# EAGLE design rcz80cpuv1 (EAGLE 9.6.2)
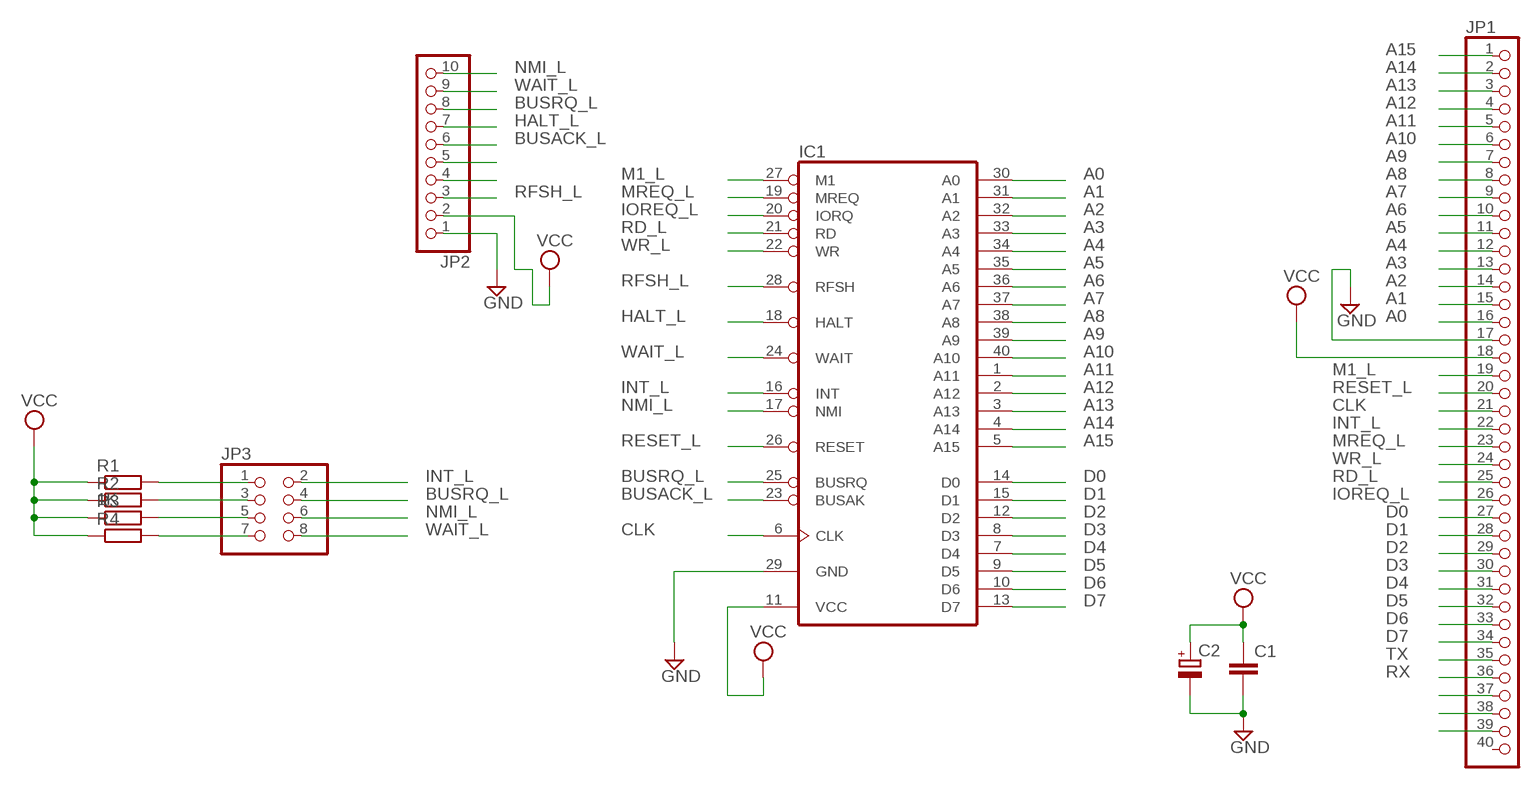
[diagram p0: schematic, sheet 1]

## Parts
C1  C-EU025-024X044  [C025-024X044]
C2  CPOL-EUE2,5-6E  [E2,5-6E]
IC1  Z80CPU  [DIL40]
JP1  PINHD-1X40  [1X40]
JP2  PINHD-1X10  [1X10]
JP3  PINHD-2X4  [2X04]
R1  1K  R-EU_0204/7  [0204/7]
R2  R-EU_0204/7  [0204/7]
R3  R-EU_0204/7  [0204/7]
R4  R-EU_0204/7  [0204/7]

## Nets
A0: IC1.30(A0) JP1.16
A1: IC1.31(A1) JP1.15
A2: IC1.32(A2) JP1.14
A3: IC1.33(A3) JP1.13
A4: IC1.34(A4) JP1.12
A5: IC1.35(A5) JP1.11
A6: IC1.36(A6) JP1.10
A7: IC1.37(A7) JP1.9
A8: IC1.38(A8) JP1.8
A9: IC1.39(A9) JP1.7
A10: IC1.40(A10) JP1.6
A11: IC1.1(A11) JP1.5
A12: IC1.2(A12) JP1.4
A13: IC1.3(A13) JP1.3
A14: IC1.4(A14) JP1.2
A15: IC1.5(A15) JP1.1
BUSACK_L: IC1.23(BUSAK) JP2.6
BUSRQ_L: IC1.25(BUSRQ) JP2.8 JP3.4
CLK: IC1.6(CLK) JP1.21
D0: IC1.14(D0) JP1.27
D1: IC1.15(D1) JP1.28
D2: IC1.12(D2) JP1.29
D3: IC1.8(D3) JP1.30
D4: IC1.7(D4) JP1.31
D5: IC1.9(D5) JP1.32
D6: IC1.10(D6) JP1.33
D7: IC1.13(D7) JP1.34
GND: C1.2 C2.- IC1.29(GND) JP1.17 JP2.1
HALT_L: IC1.18(HALT) JP2.7
INT_L: IC1.16(INT) JP1.22 JP3.2
IOREQ_L: IC1.20(IORQ) JP1.26
M1_L: IC1.27(M1) JP1.19
MREQ_L: IC1.19(MREQ) JP1.23
N$1: JP1.37
N$2: JP1.38
N$3: JP1.39
N$4: JP3.1 R1.2
N$5: JP3.3 R2.2
N$6: JP2.5
N$7: JP2.4
N$8: JP3.5 R3.2
N$9: JP3.7 R4.2
NMI_L: IC1.17(NMI) JP2.10 JP3.6
RD_L: IC1.21(RD) JP1.25
RESET_L: IC1.26(RESET) JP1.20
RFSH_L: IC1.28(RFSH) JP2.3
RX: JP1.36
TX: JP1.35
VCC: C1.1 C2.+ IC1.11(VCC) JP1.18 JP2.2 R1.1 R2.1 R3.1 R4.1
WAIT_L: IC1.24(WAIT) JP2.9 JP3.8
WR_L: IC1.22(WR) JP1.24
Unconnected: JP1.40

## Library data of the parts
C1 = rcl:C-EU: CAPACITOR, European symbol; SPICEPREFIX: C
C2 = rcl:CPOL-EU: POLARIZED CAPACITOR, European symbol; SPICEPREFIX: C
IC1 = zilog:Z80CPU: Z80 FAMILY DEVICE
JP1 = pinhead:PINHD-1X40: PIN HEADER
JP2 = pinhead:PINHD-1X10: PIN HEADER
JP3 = pinhead:PINHD-2X4: PIN HEADER
R1-R4 = rcl:R-EU_: RESISTOR, European symbol; SPICEPREFIX: R

## Board
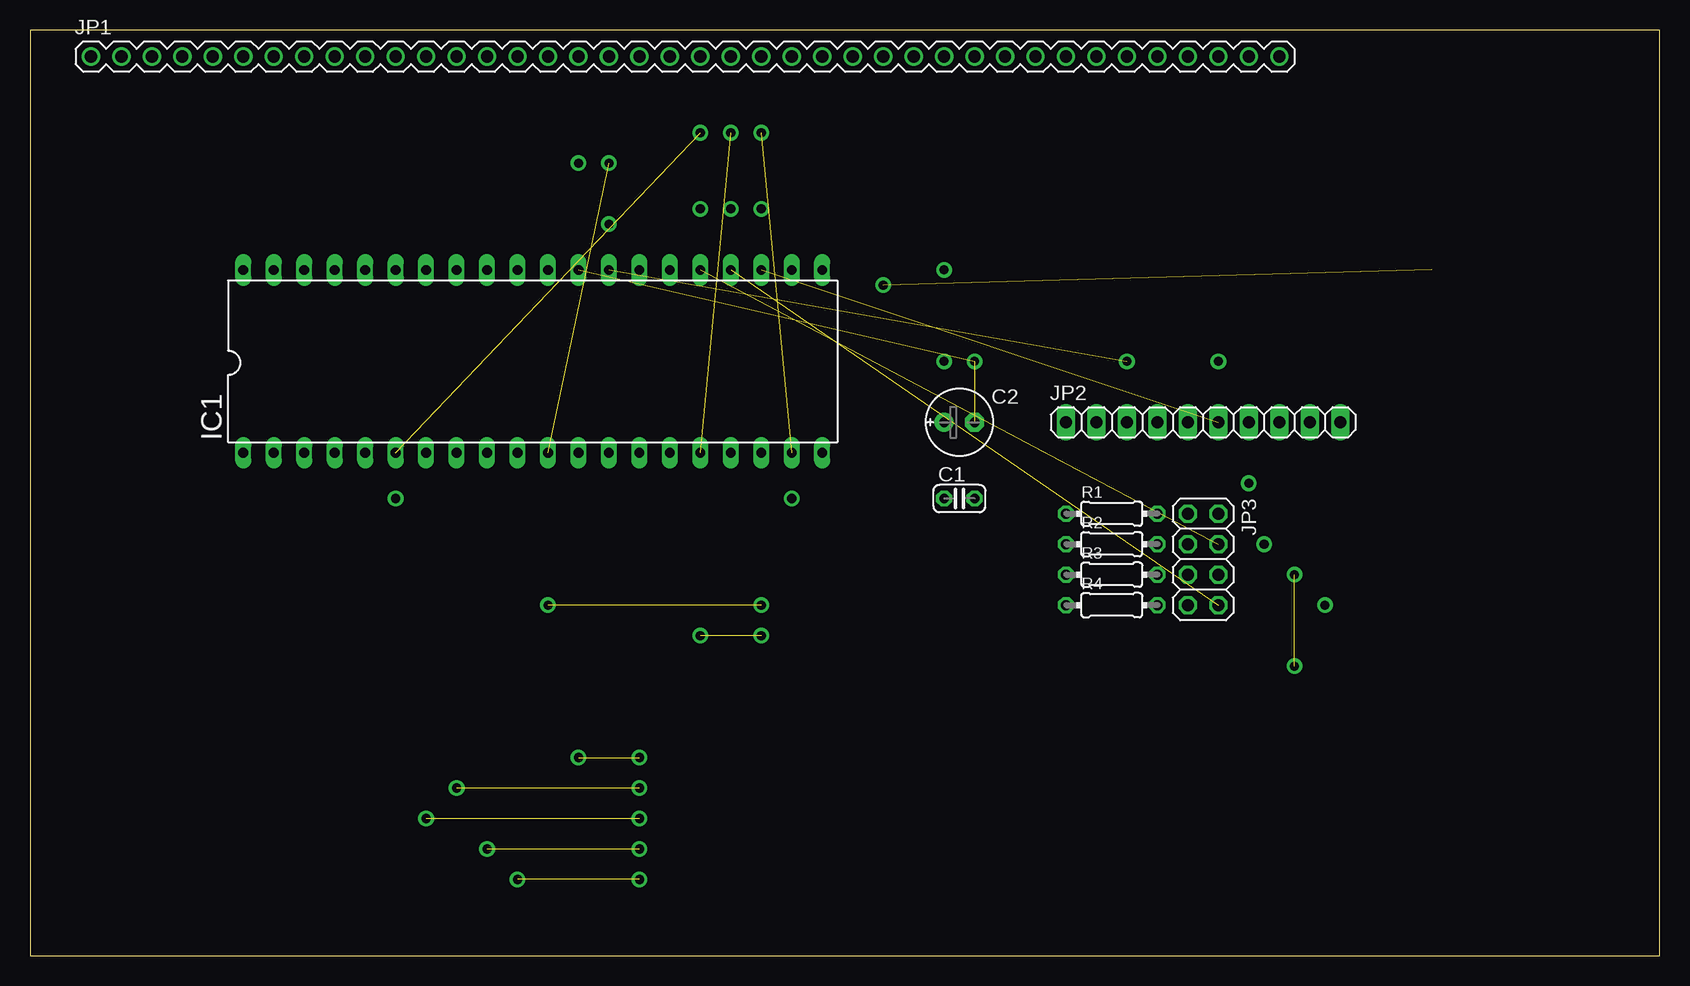
[diagram p1: board, top side]
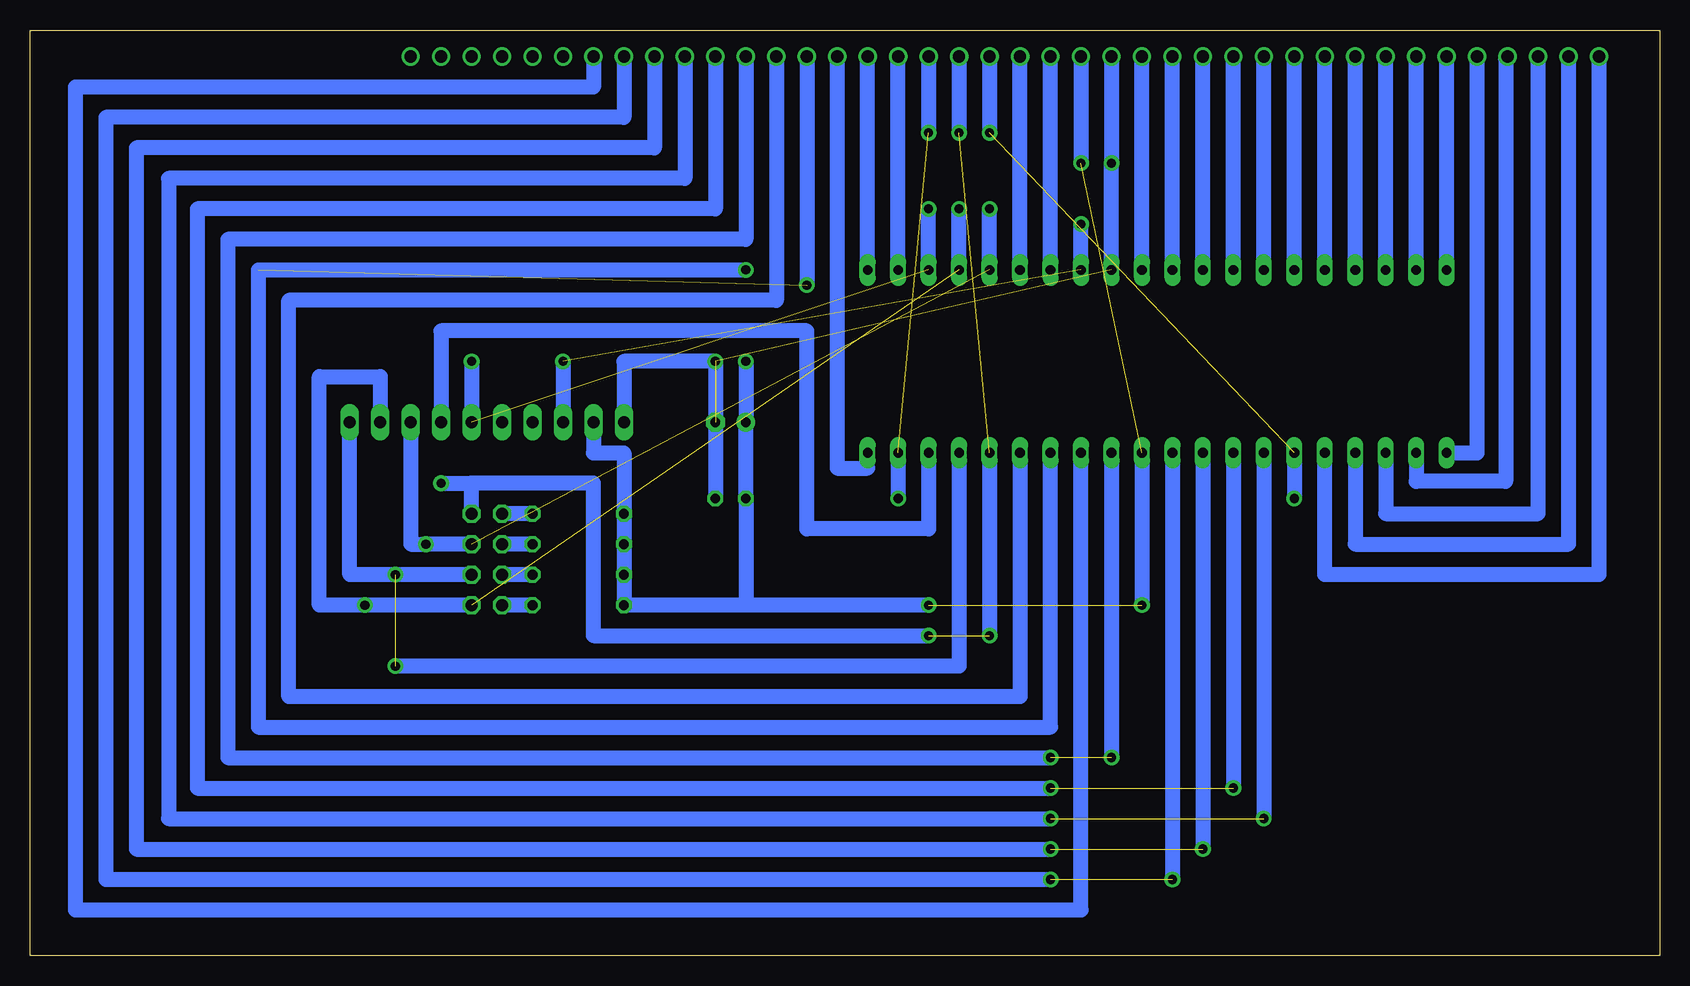
[diagram p2: board, bottom side, seen from below]

Size 135.87 x 77.14 mm. Coordinates in mm from the lower left corner, seen from the top.
Outline: 0,0 135.87,0 135.87,77.14 0,77.14 0,0
Copper layers (1*16): Top 0.035mm / dielectric 1.5mm / Bottom 0.035mm
Design rules "default": minimum track width 6mil, minimum drill 0.35mm, track to track 6mil, track to pad 6mil, pad to pad 6mil, via to via 6mil, smd to smd 6mil, copper to edge 40mil, drill to drill 6mil, minimum pad ring 10mil, minimum via ring 8mil, stop-mask expansion 4mil, vias tented up to drill 0mil, thermal gap 10mil

### Footprints (pad centres in the part's own frame; a part is rotated, then mirrored left to right if it is on the bottom)
C025-024X044 = drill 0.813 octagon: 1 -1.27,0; 2 1.27,0
E2,5-6E = drill 0.813 pad 1.575: + -1.27,0 | drill 0.813 pad 1.575 octagon: - 1.27,0
DIL40 = drill 0.813 long: 1 -24.13,-7.62; 2 -21.59,-7.62; 3 -19.05,-7.62; 4 -16.51,-7.62; 5 -13.97,-7.62; 6 -11.43,-7.62; 7 -8.89,-7.62; 8 -6.35,-7.62; 9 -3.81,-7.62; 10 -1.27,-7.62; 11 1.27,-7.62; 12 3.81,-7.62; 13 6.35,-7.62; 14 8.89,-7.62; 15 11.43,-7.62; 16 13.97,-7.62; 17 16.51,-7.62; 18 19.05,-7.62; 19 21.59,-7.62; 20 24.13,-7.62; 21 24.13,7.62; 22 21.59,7.62; 23 19.05,7.62; 24 16.51,7.62; 25 13.97,7.62; 26 11.43,7.62; 27 8.89,7.62; 28 6.35,7.62; 29 3.81,7.62; 30 1.27,7.62; 31 -1.27,7.62; 32 -3.81,7.62; 33 -6.35,7.62; 34 -8.89,7.62; 35 -11.43,7.62; 36 -13.97,7.62; 37 -16.51,7.62; 38 -19.05,7.62; 39 -21.59,7.62; 40 -24.13,7.62
1X40 = drill 1.016: 1 -49.53,0; 2 -46.99,0; 3 -44.45,0; 4 -41.91,0; 5 -39.37,0; 6 -36.83,0; 7 -34.29,0; 8 -31.75,0; 9 -29.21,0; 10 -26.67,0; 11 -24.13,0; 12 -21.59,0; 13 -19.05,0; 14 -16.51,0; 15 -13.97,0; 16 -11.43,0; 17 -8.89,0; 18 -6.35,0; 19 -3.81,0; 20 -1.27,0; 21 1.27,0; 22 3.81,0; 23 6.35,0; 24 8.89,0; 25 11.43,0; 26 13.97,0; 27 16.51,0; 28 19.05,0; 29 21.59,0; 30 24.13,0; 31 26.67,0; 32 29.21,0; 33 31.75,0; 34 34.29,0; 35 36.83,0; 36 39.37,0; 37 41.91,0; 38 44.45,0; 39 46.99,0; 40 49.53,0
1X10 = drill 1.016 long: 1 -11.43,0; 2 -8.89,0; 3 -6.35,0; 4 -3.81,0; 5 -1.27,0; 6 1.27,0; 7 3.81,0; 8 6.35,0; 9 8.89,0; 10 11.43,0
2X04 = drill 1.016 octagon: 1 -3.81,-1.27; 2 -3.81,1.27; 3 -1.27,-1.27; 4 -1.27,1.27; 5 1.27,-1.27; 6 1.27,1.27; 7 3.81,-1.27; 8 3.81,1.27
0204/7 = drill 0.813 octagon: 1 -3.81,0; 2 3.81,0

### Placement (x,y rotation side)
C1  77.47,38.1 0 top
C2  77.47,44.45 0 top
IC1  41.91,49.53 0 top
JP1  54.61,74.93 0 top
JP2  97.79,44.45 0 top
JP3  97.79,33.02 270 top
R1  90.17,36.83 0 top
R2  90.17,34.29 0 top
R3  90.17,31.75 0 top
R4  90.17,29.21 0 top

### Tracks (layer width: path | path; a pad name or v marks a point on that pad's centre or on a via)
A0
  Bottom 1.27: IC1.30 JP1.16
A1
  Bottom 1.27: IC1.31 JP1.15
A2
  Bottom 1.27: IC1.32 JP1.14
A3
  Bottom 1.27: IC1.33 JP1.13
A4
  Bottom 1.27: IC1.34 JP1.12
A5
  Bottom 1.27: IC1.35 JP1.11
A6
  Bottom 1.27: IC1.36 JP1.10
A7
  Bottom 1.27: IC1.37 JP1.9
A8
  Bottom 1.27: IC1.38 JP1.8
A9
  Bottom 1.27: IC1.39 JP1.7
A10
  Bottom 1.27: IC1.40 JP1.6
A11
  Bottom 1.27: IC1.1 15.24,41.91 JP1.5
A12
  Bottom 1.27: IC1.2 20.32,39.52 12.85,39.52 12.85,74.78 JP1.4
A13
  Bottom 1.27: IC1.3 22.86,36.83 10.16,36.83 JP1.3
A14
  Bottom 1.27: IC1.4 25.4,34.29 7.62,34.29 JP1.2
A15
  Bottom 1.27: IC1.5 27.94,31.75 5.08,31.75 JP1.1
BUSACK_L  (via drill 0.76 pad 1.3)  (1 unrouted)
  Bottom 1.27: IC1.23 v60.96,62.23 | v99.06,49.53 JP2.6
BUSRQ_L  (via drill 0.76 pad 1.3)  (1 unrouted)
  Bottom 1.27: IC1.25 v55.88,62.23 | JP3.4 v102.87,34.29 104.14,34.29 JP2.8
CLK  (via drill 0.76 pad 1.3)  (1 unrouted)
  Bottom 1.27: IC1.6 v30.48,38.1 | JP1.21 v55.88,68.58
D0  (via drill 0.76 pad 1.3)  (1 unrouted)
  Bottom 1.27: JP1.27 v71.12,55.88 | IC1.14 50.8,19.05 116.84,19.05 116.84,57.15 v76.2,57.15
D1
  Bottom 1.27: IC1.15 53.34,21.59 114.3,21.59 114.3,54.61 73.66,54.61 JP1.28
D2  (via drill 0.76 pad 1.3)  (1 unrouted)
  Bottom 1.27: IC1.12 v45.72,16.51 | JP1.29 76.2,59.69 119.38,59.69 119.38,16.51 v50.8,16.51
D3  (via drill 0.76 pad 1.3)  (1 unrouted)
  Bottom 1.27: IC1.8 v35.56,13.97 | JP1.30 78.74,62.23 121.92,62.23 121.92,13.97 v50.8,13.97
D4  (via drill 0.76 pad 1.3)  (1 unrouted)
  Bottom 1.27: IC1.7 v33.02,11.43 | JP1.31 81.28,64.77 124.31,64.77 124.31,11.43 v50.8,11.43
D5  (via drill 0.76 pad 1.3)  (1 unrouted)
  Bottom 1.27: IC1.9 v38.1,8.89 | JP1.32 83.82,67.31 127,67.31 127,8.89 v50.8,8.89
D6  (via drill 0.76 pad 1.3)  (1 unrouted)
  Bottom 1.27: IC1.10 v40.64,6.35 | JP1.33 86.36,69.85 129.54,69.85 129.54,6.35 v50.8,6.35
D7
  Bottom 1.27: IC1.13 48.26,3.81 132.08,3.81 132.08,72.39 88.9,72.39 JP1.34
GND  (via drill 0.76 pad 1.3)  (2 unrouted)
  Bottom 1.27: IC1.29 v45.72,66.04 JP1.17 | C1.2 v78.74,49.53 86.36,49.53 JP2.1
HALT_L
  Bottom 1.27: IC1.18 60.96,35.56 71.12,35.56 71.12,52.07 101.6,52.07 JP2.7
INT_L  (via drill 0.76 pad 1.3)  (2 unrouted)
  Bottom 1.27: JP1.22 v58.42,68.58 | IC1.16 v55.88,26.67 | v60.96,26.67 88.9,26.67 88.9,39.37 99.06,39.37 | JP3.2 99.06,39.37 | v101.6,39.37 99.06,39.37
IOREQ_L
  Bottom 1.27: JP1.26 68.58,40.64 66.04,40.64 IC1.20
M1_L
  Bottom 1.27: IC1.27 JP1.19
MREQ_L  (via drill 0.76 pad 1.3)  (1 unrouted)
  Bottom 1.27: JP1.23 v60.96,68.58 | IC1.19 v63.5,38.1
N$4
  Bottom 1.27: R1.2 JP3.1
N$5
  Bottom 1.27: R2.2 JP3.3
N$8
  Bottom 1.27: R3.2 JP3.5
N$9
  Bottom 1.27: R4.2 JP3.7
NMI_L  (via drill 0.76 pad 1.3)  (1 unrouted)
  Bottom 1.27: IC1.17 58.42,24.13 v105.41,24.13 | JP3.6 v105.41,31.75 109.22,31.75 JP2.10
RD_L
  Bottom 1.27: IC1.21 JP1.25
RESET_L
  Bottom 1.27: IC1.26 JP1.20
RFSH_L  (via drill 0.76 pad 1.3)  (1 unrouted)
  Bottom 1.27: IC1.28 v48.26,60.96 | v91.44,49.53 JP2.3
VCC  (via drill 0.76 pad 1.3)  (2 unrouted)
  Bottom 1.27: IC1.11 v43.18,29.21 | JP2.2 88.9,41.91 86.36,41.91 R1.1 R2.1 R3.1 R4.1 76.2,29.21 | v60.96,29.21 76.2,29.21 | 76.2,29.21 C1.1 C2.+ v76.2,49.53 | JP1.18 v48.26,66.04
WAIT_L  (via drill 0.76 pad 1.3)  (1 unrouted)
  Bottom 1.27: IC1.24 v58.42,62.23 | JP3.8 v107.95,29.21 111.76,29.21 111.76,48.26 106.68,48.26 JP2.9
WR_L
  Bottom 1.27: IC1.22 JP1.24